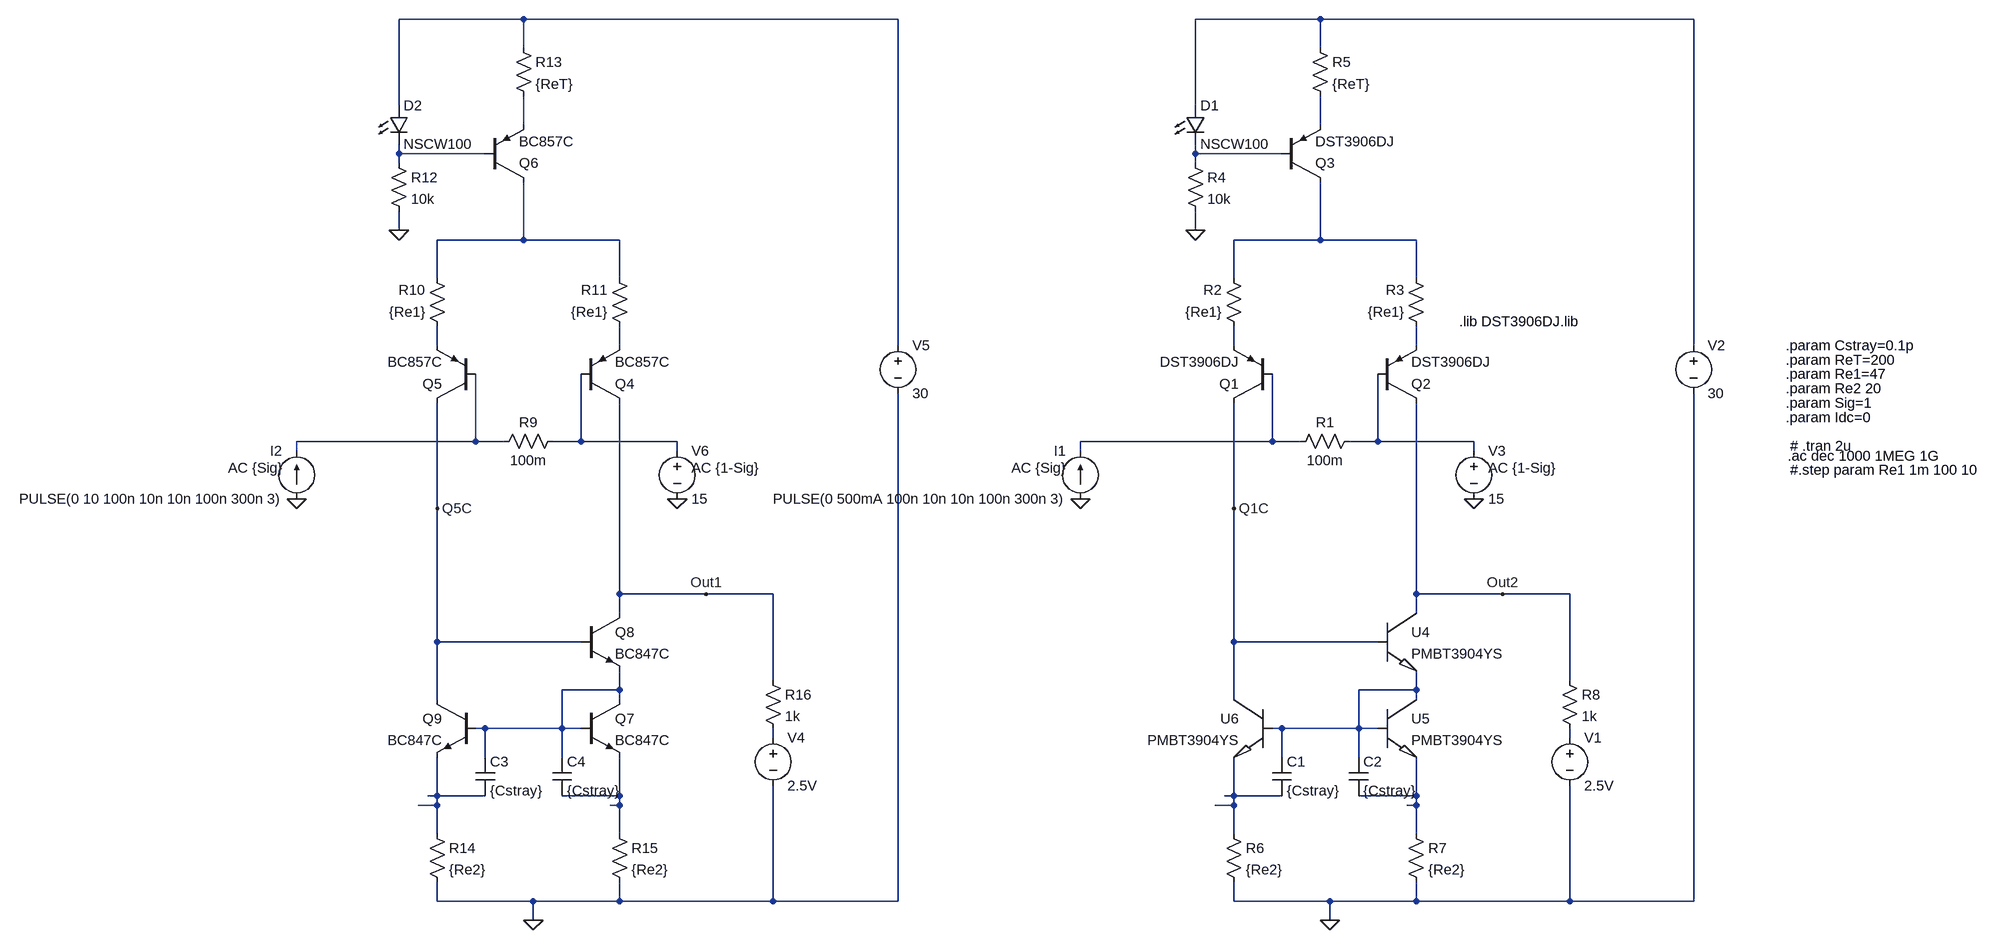
[diagram p0: schematic current-amp-test.asc]
current-amp-test.asc, the LTspice schematic file:
Version 4
SHEET 1 1708 680
WIRE -1216 -1312 -1424 -1312
WIRE -592 -1312 -1216 -1312
WIRE 112 -1312 -96 -1312
WIRE 736 -1312 112 -1312
WIRE -1216 -1264 -1216 -1312
WIRE 112 -1264 112 -1312
WIRE -1424 -1168 -1424 -1312
WIRE -96 -1168 -96 -1312
WIRE -1216 -1136 -1216 -1184
WIRE 112 -1136 112 -1184
WIRE -1424 -1088 -1424 -1104
WIRE -1280 -1088 -1424 -1088
WIRE -96 -1088 -96 -1104
WIRE 48 -1088 -96 -1088
WIRE -1424 -1072 -1424 -1088
WIRE -96 -1072 -96 -1088
WIRE -1424 -960 -1424 -992
WIRE -96 -960 -96 -992
WIRE -1216 -944 -1216 -1040
WIRE -1216 -944 -1360 -944
WIRE -1056 -944 -1216 -944
WIRE 112 -944 112 -1040
WIRE 112 -944 -32 -944
WIRE 272 -944 112 -944
WIRE -1360 -880 -1360 -944
WIRE -1056 -880 -1056 -944
WIRE -32 -880 -32 -944
WIRE 272 -880 272 -944
WIRE -1360 -768 -1360 -800
WIRE -1056 -768 -1056 -800
WIRE -592 -768 -592 -1312
WIRE -32 -768 -32 -800
WIRE 272 -768 272 -800
WIRE 736 -768 736 -1312
WIRE -1296 -608 -1296 -720
WIRE -1296 -608 -1616 -608
WIRE -1248 -608 -1296 -608
WIRE -1120 -608 -1120 -720
WIRE -1120 -608 -1168 -608
WIRE -960 -608 -1120 -608
WIRE 32 -608 32 -720
WIRE 32 -608 -288 -608
WIRE 80 -608 32 -608
WIRE 208 -608 208 -720
WIRE 208 -608 160 -608
WIRE 368 -608 208 -608
WIRE -1616 -592 -1616 -608
WIRE -960 -592 -960 -608
WIRE -288 -592 -288 -608
WIRE 368 -592 368 -608
WIRE -1360 -496 -1360 -672
WIRE -32 -496 -32 -672
WIRE -1056 -320 -1056 -672
WIRE -912 -320 -1056 -320
WIRE -800 -320 -912 -320
WIRE 272 -320 272 -672
WIRE 416 -320 272 -320
WIRE 528 -320 416 -320
WIRE -1056 -288 -1056 -320
WIRE 272 -288 272 -320
WIRE -1360 -240 -1360 -496
WIRE -1120 -240 -1360 -240
WIRE -32 -240 -32 -496
WIRE 208 -240 -32 -240
WIRE -800 -176 -800 -320
WIRE 528 -176 528 -320
WIRE -1056 -160 -1056 -192
WIRE -1056 -160 -1152 -160
WIRE 272 -160 272 -192
WIRE 272 -160 176 -160
WIRE -1360 -144 -1360 -240
WIRE -1056 -144 -1056 -160
WIRE -32 -144 -32 -240
WIRE 272 -144 272 -160
WIRE -1280 -96 -1296 -96
WIRE -1152 -96 -1152 -160
WIRE -1152 -96 -1280 -96
WIRE -1120 -96 -1152 -96
WIRE 48 -96 32 -96
WIRE 176 -96 176 -160
WIRE 176 -96 48 -96
WIRE 208 -96 176 -96
WIRE -800 -80 -800 -96
WIRE 528 -80 528 -96
WIRE -1280 -48 -1280 -96
WIRE -1152 -48 -1152 -96
WIRE 48 -48 48 -96
WIRE 176 -48 176 -96
WIRE -1360 16 -1360 -48
WIRE -1360 16 -1376 16
WIRE -1280 16 -1360 16
WIRE -1056 16 -1056 -48
WIRE -1056 16 -1152 16
WIRE -32 16 -32 -48
WIRE -32 16 -48 16
WIRE 48 16 -32 16
WIRE 272 16 272 -48
WIRE 272 16 176 16
WIRE -1360 32 -1360 16
WIRE -1360 32 -1392 32
WIRE -1056 32 -1056 16
WIRE -1056 32 -1072 32
WIRE -32 32 -32 16
WIRE -32 32 -64 32
WIRE 272 32 272 16
WIRE 272 32 256 32
WIRE -1360 80 -1360 32
WIRE -1056 80 -1056 32
WIRE -32 80 -32 32
WIRE 272 80 272 32
WIRE -1360 192 -1360 160
WIRE -1200 192 -1360 192
WIRE -1056 192 -1056 160
WIRE -1056 192 -1200 192
WIRE -800 192 -800 0
WIRE -800 192 -1056 192
WIRE -592 192 -592 -688
WIRE -592 192 -800 192
WIRE -32 192 -32 160
WIRE 128 192 -32 192
WIRE 272 192 272 160
WIRE 272 192 128 192
WIRE 528 192 528 0
WIRE 528 192 272 192
WIRE 736 192 736 -688
WIRE 736 192 528 192
WIRE -1200 224 -1200 192
WIRE 128 224 128 192
FLAG -96 -960 0
FLAG 128 224 0
FLAG 368 -512 0
FLAG -288 -512 0
FLAG 416 -320 Out2
FLAG -32 -496 Q1C
FLAG -1424 -960 0
FLAG -1200 224 0
FLAG -960 -512 0
FLAG -1616 -512 0
FLAG -912 -320 Out1
FLAG -1360 -496 Q5C
DATAFLAG -32 -336 "Ic(Q1)"
DATAFLAG 272 -496 "Ic(Q2)"
DATAFLAG -48 32 ""
DATAFLAG 256 32 ""
DATAFLAG -1360 -336 "Ic(Q5)"
DATAFLAG -1056 -496 "Ic(Q4)"
DATAFLAG -1376 32 ""
DATAFLAG -1072 32 ""
DATAFLAG -1360 -784 "I(R10)"
DATAFLAG 112 -1168 ""
DATAFLAG -1216 -1168 ""
SYMBOL pnp 208 -672 M180
SYMATTR InstName Q2
SYMATTR Value DST3906DJ
SYMBOL pnp 32 -672 R180
SYMATTR InstName Q1
SYMATTR Value DST3906DJ
SYMBOL res 176 -624 R90
WINDOW 0 0 56 VBottom 2
WINDOW 3 32 56 VTop 2
SYMATTR InstName R1
SYMATTR Value 100m
SYMBOL res -16 -784 R180
WINDOW 0 36 76 Left 2
WINDOW 3 36 40 Left 2
SYMATTR InstName R2
SYMATTR Value {Re1}
SYMBOL res 288 -784 R180
WINDOW 0 36 76 Left 2
WINDOW 3 36 40 Left 2
SYMATTR InstName R3
SYMATTR Value {Re1}
SYMBOL pnp 48 -1040 M180
SYMATTR InstName Q3
SYMATTR Value DST3906DJ
SYMBOL LED -112 -1168 R0
SYMATTR InstName D1
SYMATTR Value NSCW100
SYMATTR Description Diode
SYMATTR Type diode
SYMBOL res -112 -1088 R0
SYMATTR InstName R4
SYMATTR Value 10k
SYMBOL res 96 -1280 R0
SYMATTR InstName R5
SYMATTR Value {ReT}
SYMBOL res -48 64 R0
SYMATTR InstName R6
SYMATTR Value {Re2}
SYMBOL res 256 64 R0
SYMATTR InstName R7
SYMATTR Value {Re2}
SYMBOL voltage 528 -96 R0
SYMATTR InstName V1
SYMATTR Value 2.5V
SYMBOL res 512 -192 R0
SYMATTR InstName R8
SYMATTR Value 1k
SYMBOL voltage 736 -784 R0
SYMATTR InstName V2
SYMATTR Value 30
SYMBOL voltage 368 -608 R0
WINDOW 123 24 44 Left 2
WINDOW 39 0 0 Left 0
SYMATTR Value2 AC {1-Sig}
SYMATTR InstName V3
SYMATTR Value 15
SYMBOL current -288 -512 R180
WINDOW 0 24 80 Left 2
WINDOW 3 24 0 Left 2
WINDOW 123 24 52 Left 2
WINDOW 39 0 0 Left 0
SYMATTR InstName I1
SYMATTR Value PULSE(0 500mA 100n 10n 10n 100n 300n 3)
SYMATTR Value2 AC {Sig}
SYMBOL cap 32 -48 R0
SYMATTR InstName C1
SYMATTR Value {Cstray}
SYMBOL cap 160 -48 R0
SYMATTR InstName C2
SYMATTR Value {Cstray}
SYMBOL pnp -1120 -672 M180
SYMATTR InstName Q4
SYMATTR Value BC857C
SYMBOL pnp -1296 -672 R180
SYMATTR InstName Q5
SYMATTR Value BC857C
SYMBOL res -1152 -624 R90
WINDOW 0 0 56 VBottom 2
WINDOW 3 32 56 VTop 2
SYMATTR InstName R9
SYMATTR Value 100m
SYMBOL res -1344 -784 R180
WINDOW 0 36 76 Left 2
WINDOW 3 36 40 Left 2
SYMATTR InstName R10
SYMATTR Value {Re1}
SYMBOL res -1040 -784 R180
WINDOW 0 36 76 Left 2
WINDOW 3 36 40 Left 2
SYMATTR InstName R11
SYMATTR Value {Re1}
SYMBOL pnp -1280 -1040 M180
SYMATTR InstName Q6
SYMATTR Value BC857C
SYMBOL LED -1440 -1168 R0
SYMATTR InstName D2
SYMATTR Value NSCW100
SYMATTR Description Diode
SYMATTR Type diode
SYMBOL res -1440 -1088 R0
SYMATTR InstName R12
SYMATTR Value 10k
SYMBOL res -1232 -1280 R0
SYMATTR InstName R13
SYMATTR Value {ReT}
SYMBOL res -1376 64 R0
SYMATTR InstName R14
SYMATTR Value {Re2}
SYMBOL res -1072 64 R0
SYMATTR InstName R15
SYMATTR Value {Re2}
SYMBOL voltage -800 -96 R0
SYMATTR InstName V4
SYMATTR Value 2.5V
SYMBOL res -816 -192 R0
SYMATTR InstName R16
SYMATTR Value 1k
SYMBOL voltage -592 -784 R0
SYMATTR InstName V5
SYMATTR Value 30
SYMBOL voltage -960 -608 R0
WINDOW 123 24 44 Left 2
WINDOW 39 0 0 Left 0
SYMATTR Value2 AC {1-Sig}
SYMATTR InstName V6
SYMATTR Value 15
SYMBOL current -1616 -512 R180
WINDOW 0 24 80 Left 2
WINDOW 3 24 0 Left 2
WINDOW 123 24 52 Left 2
WINDOW 39 0 0 Left 0
SYMATTR InstName I2
SYMATTR Value PULSE(0 10 100n 10n 10n 100n 300n 3)
SYMATTR Value2 AC {Sig}
SYMBOL cap -1296 -48 R0
SYMATTR InstName C3
SYMATTR Value {Cstray}
SYMBOL cap -1168 -48 R0
SYMATTR InstName C4
SYMATTR Value {Cstray}
SYMBOL npn -1120 -144 R0
SYMATTR InstName Q7
SYMATTR Value BC847C
SYMBOL npn -1120 -288 R0
SYMATTR InstName Q8
SYMATTR Value BC847C
SYMBOL npn -1296 -144 M0
SYMATTR InstName Q9
SYMATTR Value BC847C
SYMBOL PMBT3904YS 208 -288 R0
SYMATTR InstName U4
SYMBOL PMBT3904YS 208 -144 R0
SYMATTR InstName U5
SYMBOL PMBT3904YS 32 -144 M0
SYMATTR InstName U6
TEXT 896 -744 Left 2 !.param ReT=200
TEXT 896 -720 Left 2 !.param Re1=47
TEXT 896 -672 Left 2 !.param Sig=1
TEXT 896 -648 Left 2 !.param Idc=0
TEXT 904 -600 Left 2 !# .tran 2u
TEXT 896 -696 Left 2 !.param Re2 20
TEXT 904 -560 Left 2 !#.step param Re1 1m 100 10
TEXT 896 -768 Left 2 !.param Cstray=0.1p
TEXT 344 -808 Left 2 !.lib DST3906DJ.lib
TEXT 900 -584 Left 2 !.ac dec 1000 1MEG 1G

The netlist it stands for:
* current-amp-test.asc
Q2 Out2 N016 N012 0 DST3906DJ
Q1 Q1C N015 N011 0 DST3906DJ
R1 N016 N015 100m
R2 N011 N008 {Re1}
R3 N012 N008 {Re1}
Q3 N008 N006 N004 0 DST3906DJ
D1 N002 N006 NSCW100
R4 N006 0 10k
R5 N002 N004 {ReT}
R6 N023 0 {Re2}
R7 N024 0 {Re2}
V1 N020 0 2.5V
R8 Out2 N020 1k
V2 N002 0 30
V3 N016 0 15 AC {1-Sig}
I1 0 N015 PULSE(0 500mA 100n 10n 10n 100n 300n 3) AC {Sig}
C1 N018 N023 {Cstray}
C2 N018 N024 {Cstray}
Q4 Out1 N014 N010 0 BC857C
Q5 Q5C N013 N009 0 BC857C
R9 N014 N013 100m
R10 N009 N007 {Re1}
R11 N010 N007 {Re1}
Q6 N007 N005 N003 0 BC857C
D2 N001 N005 NSCW100
R12 N005 0 10k
R13 N001 N003 {ReT}
R14 N021 0 {Re2}
R15 N022 0 {Re2}
V4 N019 0 2.5V
R16 Out1 N019 1k
V5 N001 0 30
V6 N014 0 15 AC {1-Sig}
I2 0 N013 PULSE(0 10 100n 10n 10n 100n 300n 3) AC {Sig}
C3 N017 N021 {Cstray}
C4 N017 N022 {Cstray}
Q7 N017 N017 N022 0 BC847C
Q8 Out1 Q5C N017 0 BC847C
Q9 Q5C N017 N021 0 BC847C
XU4 Out2 Q1C N018 PMBT3904YS  ; pins C B E
XU5 N018 N018 N024 PMBT3904YS  ; pins C B E
XU6 Q1C N018 N023 PMBT3904YS  ; pins C B E
.model D D
.lib standard.dio
.model NPN NPN
.model PNP PNP
.lib standard.bjt
.param ReT=200
.param Re1=47
.param Sig=1
.param Idc=0
# .tran 2u
.param Re2 20
#.step param Re1 1m 100 10
.param Cstray=0.1p
.lib DST3906DJ.lib
.ac dec 1000 1MEG 1G
.lib PMBT3904YS.lib
.backanno
.end